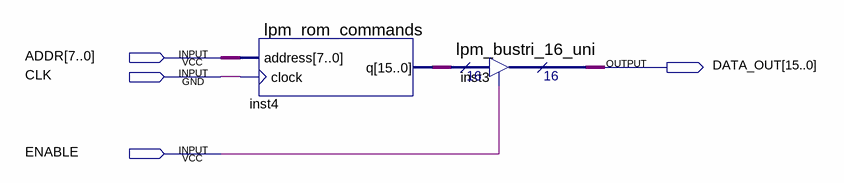
[diagram p0: schematic sheet]
// Quartus schematic memory_rom.bdf as structural Verilog: 2 symbols, 4 pins
module memory_rom (
  input  [7:0] ADDR,
  input  CLK,
  input  ENABLE,
  output [15:0] DATA_OUT
);

  wire [15:0] inst4_q;

  lpm_rom_commands inst4 (.address(ADDR), .clock(CLK), .q(inst4_q));
  lpm_bustri_16_uni inst3 (.enabledt(ENABLE), .data(inst4_q), .tridata(DATA_OUT));
endmodule
